# EAGLE design regulation-level-shifter-mk-1.0 (EAGLE 6.5.0)
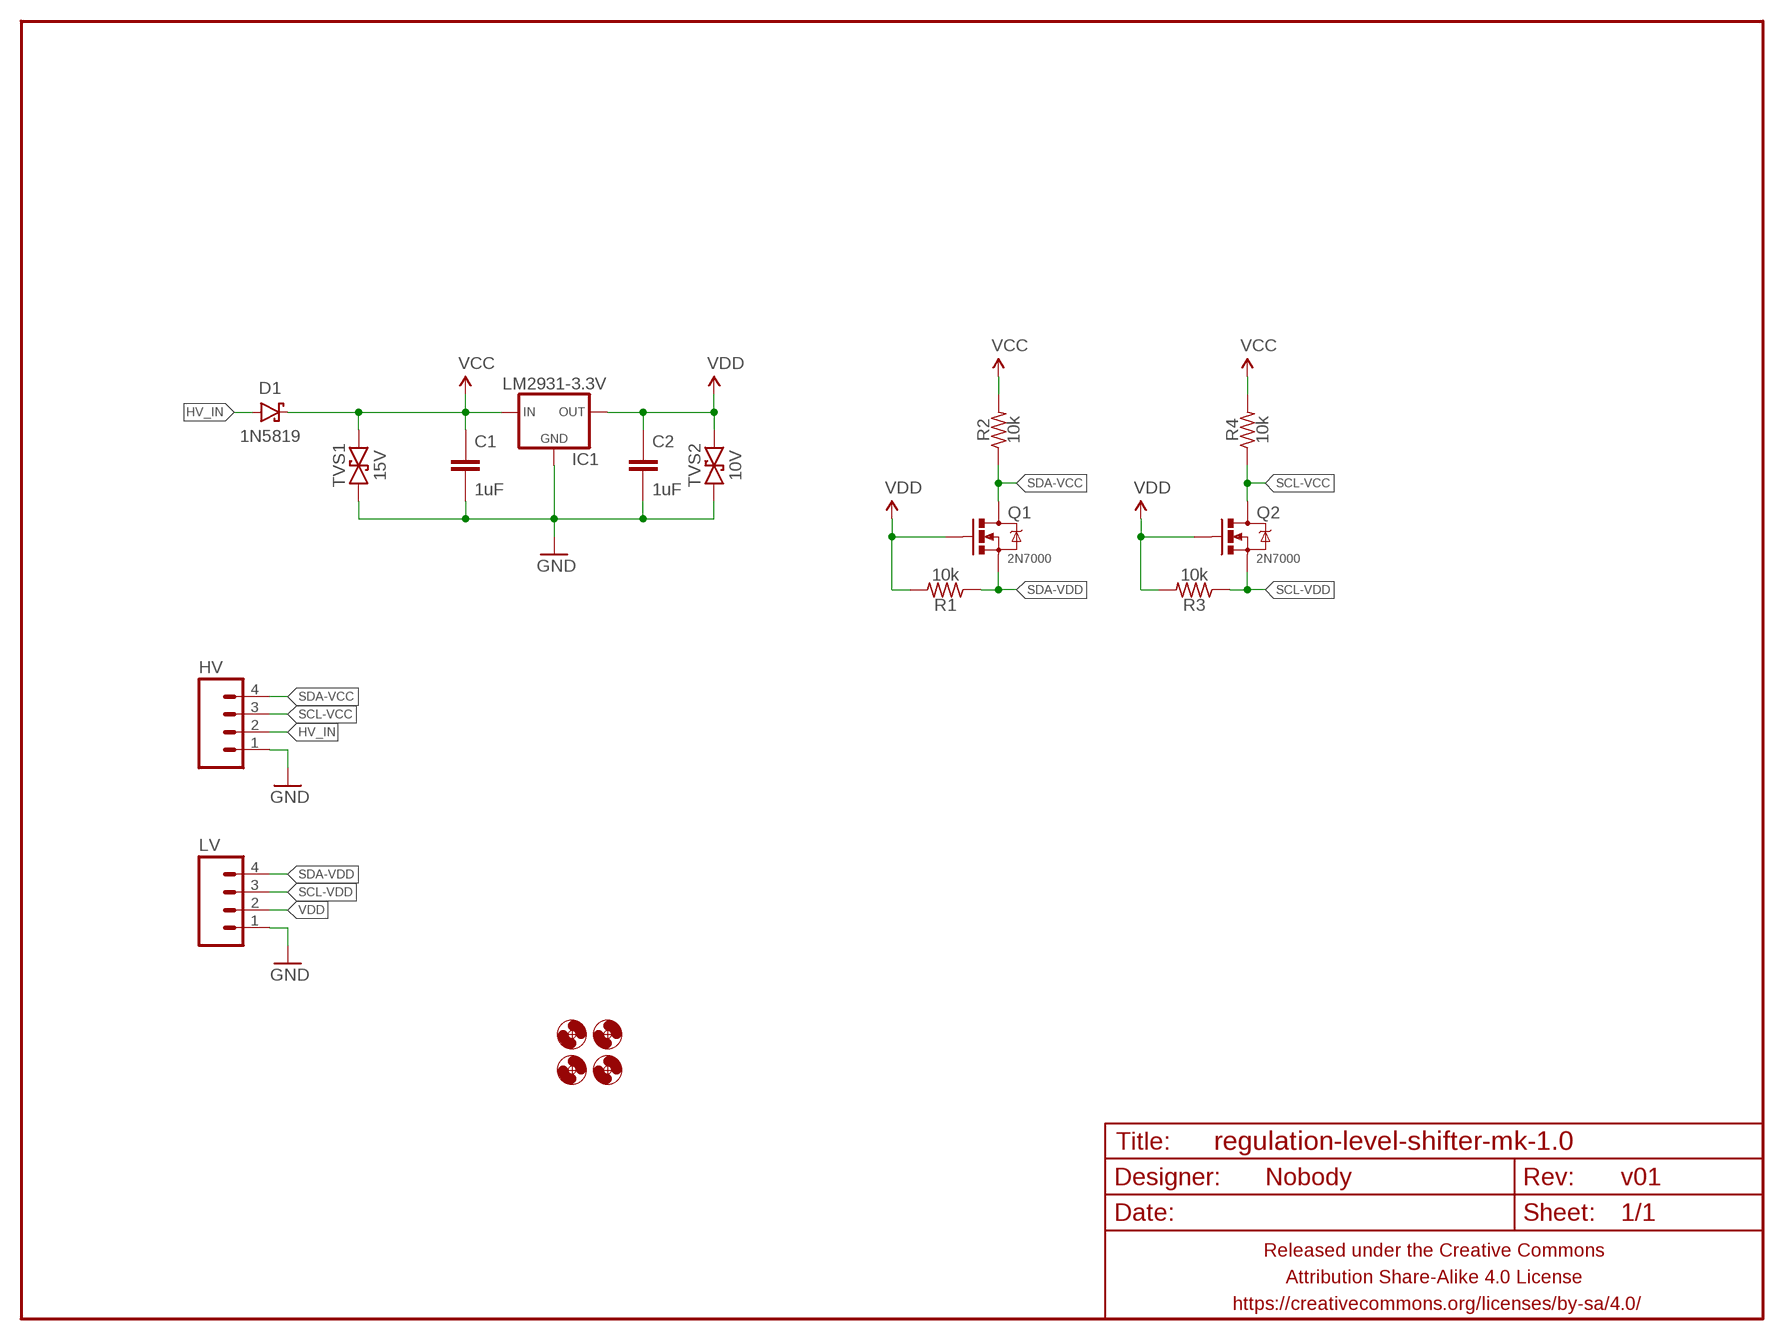
[diagram p0: schematic, sheet 1]

## Parts
C1  1uF  CAPACITOR-CERAMIC025-024X044  [C025-024X044]
C2  1uF  CAPACITOR-CERAMIC025-024X044  [C025-024X044]
D1  1N5819  DIODE-SCHOTTKYPTH-10.16MM  [DIODE-10.16MM]
FRAME1  FRAME-LETTERNO_PACKAGE  [DUMMY]
H1  HOLE#2  [HOLE-#2]
H2  HOLE#2  [HOLE-#2]
H3  HOLE#2  [HOLE-#2]
H4  HOLE#2  [HOLE-#2]
HV  M04PTH  [1X04-PTH-VERT]
IC1  LM2931-3.3V  V_REG_78XXTO-92-INLINE  [TO-92-AMMO]
LV  M04PTH  [1X04-PTH-VERT]
Q1  2N7000  MOSFET-NCHANNEL2N7000-AMMO  [TO-92-AMMO]
Q2  2N7000  MOSFET-NCHANNEL2N7000-AMMO  [TO-92-AMMO]
R1  10k  RESISTORPTH-AXIAL-5.08MM  [RESISTOR-AXIAL-PTH-5.08MM]
R2  10k  RESISTORPTH-AXIAL-5.08MM  [RESISTOR-AXIAL-PTH-5.08MM]
R3  10k  RESISTORPTH-AXIAL-5.08MM  [RESISTOR-AXIAL-PTH-5.08MM]
R4  10k  RESISTORPTH-AXIAL-5.08MM  [RESISTOR-AXIAL-PTH-5.08MM]
TVS1  15V  TVSDO-41-10.16MM  [DO-41-TVS-BI-10.16MM]
TVS2  10V  TVSDO-41-10.16MM  [DO-41-TVS-BI-10.16MM]

## Nets
GND: C1.2 C2.2 HV.1 IC1.2(GND) LV.1 TVS1.P$1 TVS2.P$1
HV_IN: D1.A HV.2
SCL-VCC: HV.3 Q2.3(D) R4.P$1
SCL-VDD: LV.3 Q2.1(S) R3.P$1
SDA-VCC: HV.4 Q1.3(D) R2.P$1
SDA-VDD: LV.4 Q1.1(S) R1.P$1
VCC: C1.1 D1.C IC1.1(IN) R2.P$2 R4.P$2 TVS1.P$2
VDD: C2.1 IC1.3(OUT) LV.2 Q1.2(G) Q2.2(G) R1.P$2 R3.P$2 TVS2.P$2

## Library data of the parts
C1 C2 = A_butts:CAPACITOR-CERAMIC: CAPACITOR, European symbol
D1 = A_butts:DIODE-SCHOTTKY: Schottky diodes in SFE's production catalog BAT20J 1A 23V 0.62Vf RB751 120mA 40V 0.37Vf PMEG4005EJ 0.5A 40V 0.42Vf MBRA140 1A 40V 0.5Vf B340A 3A 40V SMA
FRAME1 = A_butts:FRAME-LETTER: Schematic Frame Standard 8.5x11 US Letter frame; DESIGNER: Nobody; VERSION: v01
H1-H4 = A_butts:HOLE: MOUNTING HOLE with drill center marker
HV LV = A_butts:M04: Header 4 Standard 4-pin 0.1" header. Use with straight break away headers (SKU : PRT-00116), right angle break away headers (PRT-00553), swiss pins (PRT-00743), machine pins (PRT-00117), and female headers (PRT-00115). Molex polarized connector foot print use with SKU : PRT-08231 with associated crimp pins and housings. 1MM SMD Version SKU: PRT-10208
IC1 = A_butts:V_REG_78XX: Voltage Regulator Standard 7805 5V regulator. IGO (Input Ground Output). Spark Fun Electronics SKU : COM-00107
Q1 Q2 = A_butts:MOSFET-NCHANNEL: Common NMOSFET Parts MFG P/N Store ID Prod ID FDD8780 TRANS-09984 SI7820DN TRANS-11055 FDS6630A IC-08089 2N7002PW TRANS-11151 FQP30N06L COM-10213 TRANS-10060 BSS123LT1G TRANS-08345 BSS138 TRANS-00830 BS170 2N7000
R1-R4 = A_butts:RESISTOR: RESISTOR, American symbol
TVS1 TVS2 = A_butts:TVS: Transient voltage suppressor- prevents ESD on inputs. Ignore package description- MBRA140 is NOT this type of part!!!

## Board
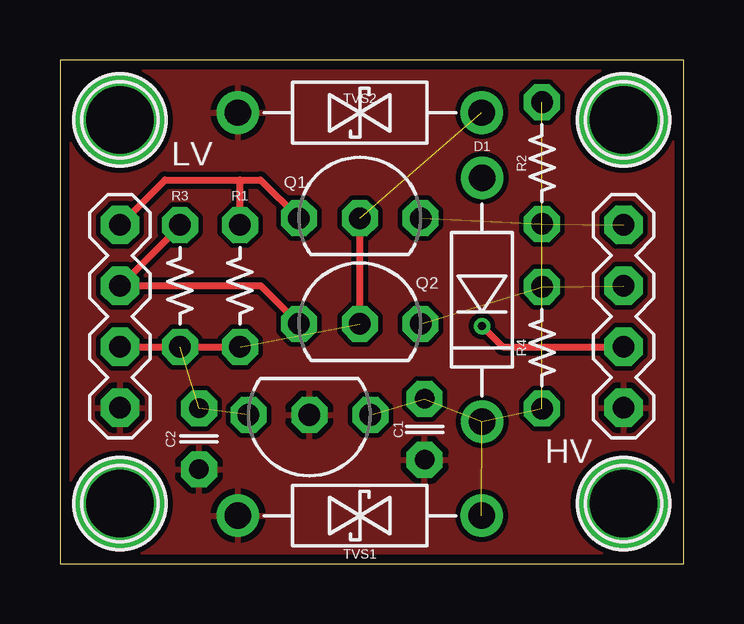
[diagram p1: board, top side]
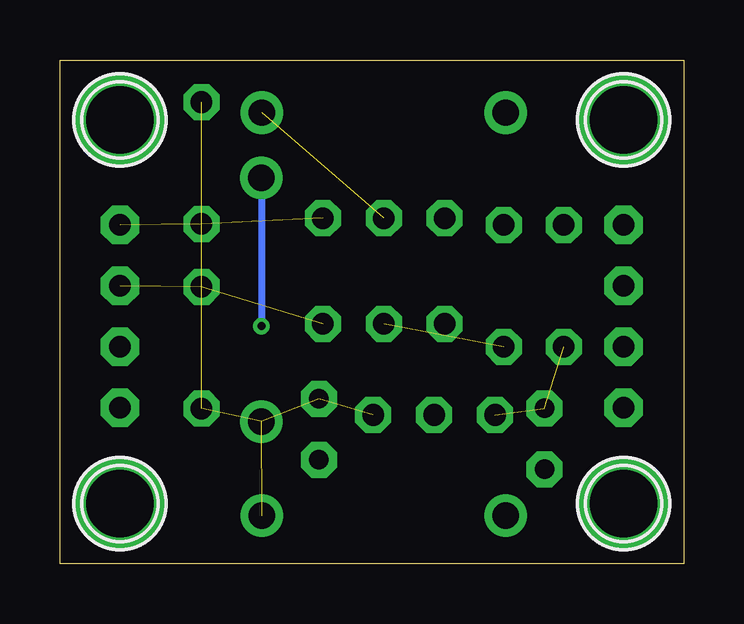
[diagram p2: board, bottom side, seen from below]

Size 26 x 21 mm. Coordinates in mm from the lower left corner, seen from the top.
Outline: 0,0 26,0 26,21 0,21 0,0
Copper layers (1*16): Top 0.0356mm / dielectric 1.5011mm / Bottom 0.0356mm
Design rules "LaenPCBOrder_2": minimum track width 6mil, minimum drill 13mil, track to track 6mil, track to pad 6mil, pad to pad 6mil, via to via 6mil, smd to smd 6mil, copper to edge 15mil, drill to drill 6mil, minimum pad ring 7mil, minimum via ring 7mil, stop-mask expansion 3mil, vias tented up to drill 20mil, thermal gap 10mil

### Footprints (pad centres in the part's own frame; a part is rotated, then mirrored left to right if it is on the bottom)
C025-024X044 = drill 0.813 pad 1.5 octagon: 1 -1.27,0; 2 1.27,0
DIODE-10.16MM = drill 1.1 pad 1.778: A -5.08,0; C 5.08,0
HOLE-#2 = drill 2.8 pad 3.81: P$1 0,0
1X04-PTH-VERT = drill 0.9 pad 1.6 octagon: 1 0,0; 2 2.54,0; 3 5.08,0; 4 7.62,0
TO-92-AMMO = drill 0.9 pad 1.5 octagon: 1 -2.54,0; 2 0,0; 3 2.54,0
RESISTOR-AXIAL-PTH-5.08MM = drill 0.9 pad 1.5 octagon: P$1 -2.54,0; P$2 2.54,0
DO-41-TVS-BI-10.16MM = drill 1.1 pad 1.778: P$1 -5.08,0; P$2 5.08,0

### Placement (x,y rotation side)
C1  15.2,5.6 270 top
C2  5.8,5.2 270 top
D1  17.6,11 270 top
FRAME1  0,0 0 top
H1  2.5,2.5 0 top
H2  23.5,2.5 0 top
H3  2.5,18.5 0 top
H4  23.5,18.5 0 top
HV  23.5,6.5 90 top
IC1  10.4,6.2 180 top
LV  2.5,6.5 90 top
Q1  12.5,14.4 0 top
Q2  12.5,10 0 top
R1  7.5,11.58 270 top
R2  20.1,16.7 90 top
R3  5,11.58 270 top
R4  20.1,9 270 top
TVS1  12.5,2 0 top
TVS2  12.5,18.8 0 top

### Tracks (layer width: path | path; a pad name or v marks a point on that pad's centre or on a via)
GND
  pour Top (isolate 0.2): 0,0 0,21 26,21 26,0
HV_IN  (via drill 0.33)
  Top 0.3: v17.6,9.9 18.46,9.04 HV.2
  Bottom 0.3: D1.A v17.6,9.9
SCL-VCC  (2 unrouted)
SCL-VDD
  Top 0.3: Q2.1 8.38,11.58 LV.3 5,14.08 R3.P$1
SDA-VCC  (2 unrouted)
SDA-VDD
  Top 0.3: Q1.1 8.36,16 7.5,16 | LV.4 4.38,16 7.5,16 | R1.P$1 7.5,16
VCC  (5 unrouted)
VDD  (4 unrouted)
  Top 0.3: Q2.2 Q1.2 | LV.2 R3.P$2 R1.P$2